# Altium schematic sheet 电源.SchDoc: 带±5V、±15V及USB供电的电源
size A4; DrawnBy: 冯某人; DocumentNumber: 1; Revision: 1
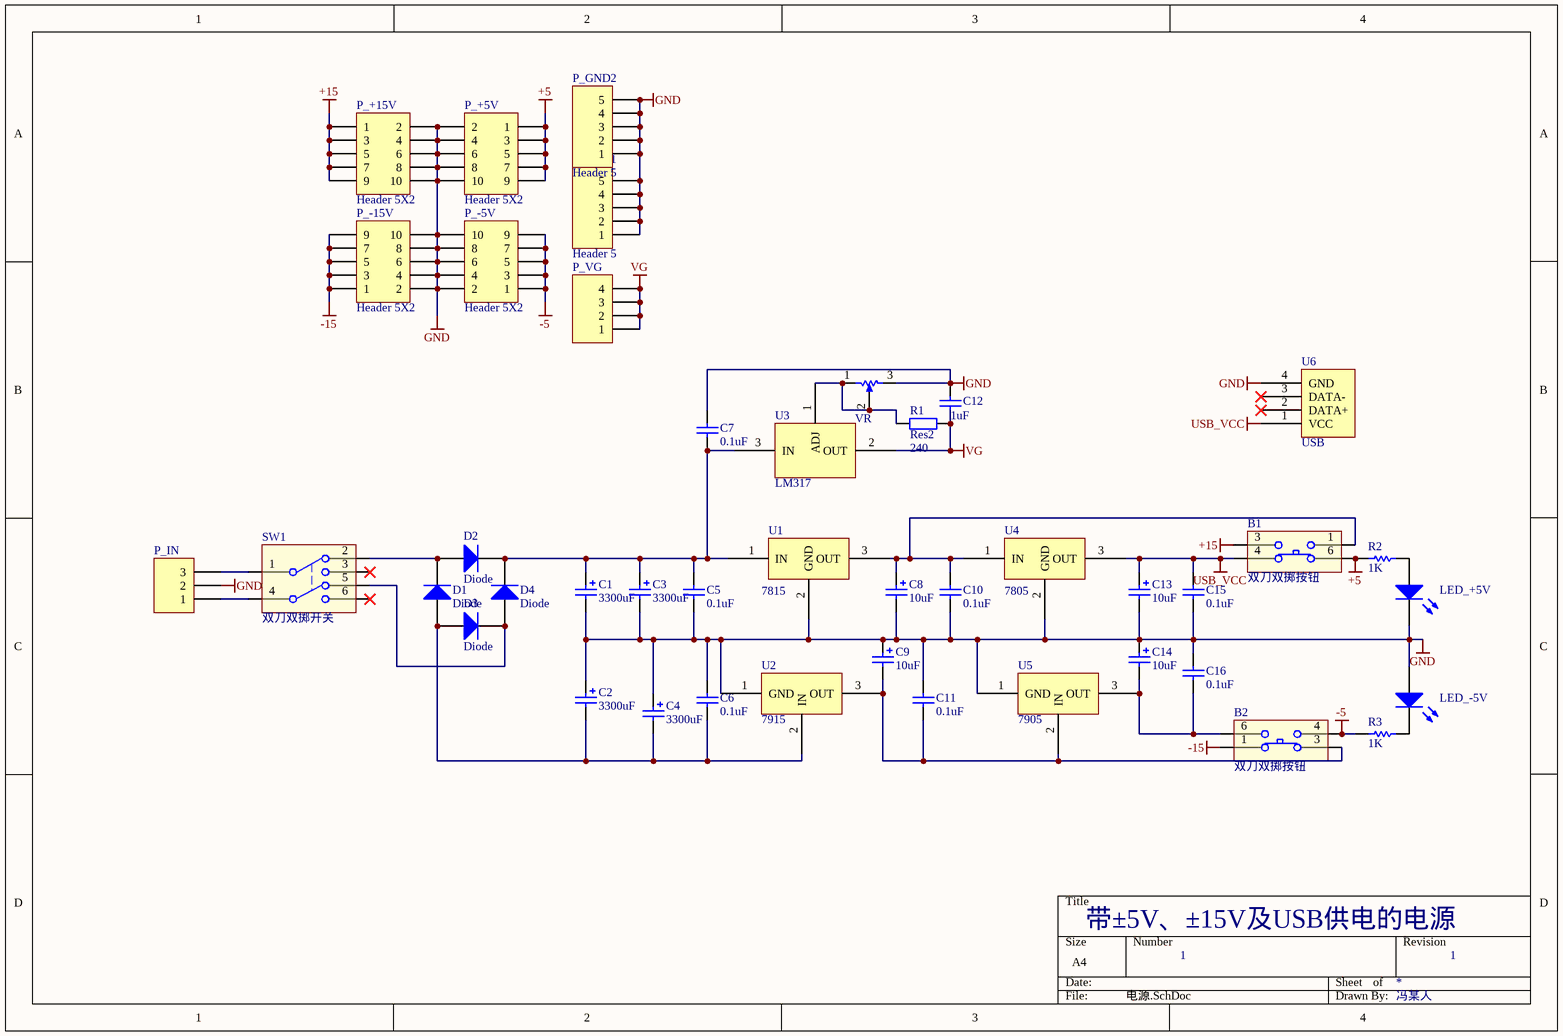
[diagram p0: 电源.SchDoc]

## Parts
B1  双刀双掷按钮  [双刀双掷开关]
B2  双刀双掷按钮  [双刀双掷开关]
C1  value 3300uF  [RB7.6-15]  (hidden comment: Cap Pol1)
C2  value 3300uF  [RB7.6-15]  (hidden comment: Cap Pol1)
C3  value 3300uF  [RB7.6-15]  (hidden comment: Cap Pol1)
C4  value 3300uF  [RB7.6-15]  (hidden comment: Cap Pol1)
C5  value 0.1uF  [RAD-0.1]  (hidden comment: Cap)
C6  value 0.1uF  [RAD-0.1]  (hidden comment: Cap)
C7  value 0.1uF  [RAD-0.1]  (hidden comment: Cap)
C8  value 10uF  [RAD-0.1]  (hidden comment: Cap Pol1)
C9  value 10uF  [RAD-0.1]  (hidden comment: Cap Pol1)
C10  value 0.1uF  [RAD-0.1]  (hidden comment: Cap)
C11  value 0.1uF  [RAD-0.1]  (hidden comment: Cap)
C12  value 1uF  [RAD-0.1]  (hidden comment: Cap)
C13  value 10uF  [RAD-0.1]  (hidden comment: Cap Pol1)
C14  value 10uF  [RAD-0.1]  (hidden comment: Cap Pol1)
C15  value 0.1uF  [RAD-0.1]  (hidden comment: Cap)
C16  value 0.1uF  [RAD-0.1]  (hidden comment: Cap)
D1  Diode  [DO-41]
D2  Diode  [DO-41]
D3  Diode  [DO-41]
D4  Diode  [DO-41]
LED_+5V  LED1  [HDR1X2]  (value not drawn)
LED_-5V  LED1  [HDR1X2]  (value not drawn)
P_+5V  Header 5X2  [HDR2X5]
P_+15V  Header 5X2  [HDR2X5]
P_-5V  Header 5X2  [HDR2X5]
P_-15V  Header 5X2  [HDR2X5]
P_GND1  Header 5  [HDR1X5]
P_GND2  Header 5  [HDR1X5]
P_IN  Header 3  [HDR1X3]  (value not drawn)
P_VG  Header 4  [HDR1X4]  (value not drawn)
R1  Res2  value 240  [AXIAL-0.3]
R2  value 1K  [AXIAL-0.3]  (hidden comment: Res Semi)
R3  value 1K  [AXIAL-0.3]  (hidden comment: Res Semi)
SW1  双刀双掷开关  [双刀双掷开关]
U1  7815  [HDR1X3]
U2  7915  [HDR1X3]
U3  LM317
U4  7805  [HDR1X3]
U5  7905  [HDR1X3]
U6  USB  [USB-A]
VR  variable resister  [HDR1X3]  (value not drawn)

## Nets
+5: B1.6 P_+5V.1 P_+5V.3 P_+5V.5 P_+5V.7 P_+5V.9 R2.2
+15: B1.3 P_+15V.1 P_+15V.3 P_+15V.5 P_+15V.7 P_+15V.9
-5: B2.4 P_-5V.1 P_-5V.3 P_-5V.5 P_-5V.7 P_-5V.9 R3.2
-15: B2.1 P_-15V.1 P_-15V.3 P_-15V.5 P_-15V.7 P_-15V.9
GND: C1.2 C2.1 C3.2 C4.1 C5.1 C6.2 C7.2 C8.2 C9.1 C10.1 C11.2 C12.1 C13.2 C14.1 C15.1 C16.2 LED_+5V.2(K) LED_-5V.1(A) P_+5V.2 P_+5V.4 P_+5V.6 P_+5V.8 P_+5V.10 P_+15V.2 P_+15V.4 P_+15V.6 P_+15V.8 P_+15V.10 P_-5V.2 P_-5V.4 P_-5V.6 P_-5V.8 P_-5V.10 P_-15V.2 P_-15V.4 P_-15V.6 P_-15V.8 P_-15V.10 P_GND1.1 P_GND1.2 P_GND1.3 P_GND1.4 P_GND1.5 P_GND2.1 P_GND2.2 P_GND2.3 P_GND2.4 P_GND2.5 P_IN.2 U1.2(GND) U2.1(GND) U4.2(GND) U5.1(GND) U6.4(GND) VR.3(ADJ)
USB_VCC: B1.4 C13.1 C15.2 U4.3(OUT) U6.1(VCC)
VG: C12.2 P_VG.1 P_VG.2 P_VG.3 P_VG.4 R1.1 U3.2(OUT)
NetB1_1: B1.1 C8.1 C10.2 U1.3(OUT) U4.1(IN)
NetB2_3: B2.3 C9.2 C11.1 U2.3(OUT) U5.2(IN)
NetB2_6: B2.6 C14.2 C16.1 U5.3(OUT)
NetC1_1: C1.1 C3.1 C5.2 C7.1 D2.2(K) D4.2(K) U1.1(IN) U3.3(IN)
NetC2_2: C2.2 C4.2 C6.1 D1.1(A) D3.1(A) U2.2(IN)
NetD1_2: D1.2(K) D2.1(A) SW1.2
NetD3_2: D3.2(K) D4.1(A) SW1.5
NetLED_+5V_1: LED_+5V.1(A) R2.1
NetLED_-5V_2: LED_-5V.2(K) R3.1
NetP_IN_1: P_IN.1 SW1.4
NetP_IN_3: P_IN.3 SW1.1
NetR1_2: R1.2 U3.1(ADJ) VR.1(IN) VR.2(OUT)

Not connected (* = marked no-connect by the designer): B1 2 5; B2 2 5; SW1 3* 6*; U6 2(DATA+)* 3(DATA-)* 5(NC) 6(NC)

## Library data of the parts
C1-C4 C8 C9 C13 C14 = Cap Pol1: Polarized Capacitor (Radial); Published: 8-Jun-2000; Publisher: Altium Limited; LatestRevisionDate: 17-Jul-2002; LatestRevisionNote: Re-released for DXP Platform.; PackageReference: RB7.6-15
C5-C7 C10-C12 C15 C16 = Cap: Capacitor; Published: 8-Jun-2000; Publisher: Altium Limited; LatestRevisionDate: 17-Jul-2002; LatestRevisionNote: Re-released for DXP Platform.; PackageReference: RAD-0.3
D1-D4 = Diode: Default Diode; Published: 8-Jun-2000; LatestRevisionDate: 17-Jul-2002; LatestRevisionNote: Re-released for DXP Platform.; PackageDocument: Sep-1996; PackageReference: SMC; Publisher: Altium Limited; Code_JEDEC: DO-214-AB
LED_+5V LED_-5V = LED1: Typical RED GaAs LED; Published: 8-Jun-2000; Publisher: Altium Limited; LatestRevisionDate: 08-Jul-2005; LatestRevisionNote: Mech Layer 1 removed.; PackageReference: LED-1
P_+5V P_+15V P_-5V P_-15V = Header 5X2: Header, 5-Pin, Dual row; Publisher: Altium Limited; LatestRevisionDate: 17-Jul-2002; LatestRevisionNote: Re-released for DXP Platform.
P_GND1 P_GND2 = Header 5: Header, 5-Pin; Publisher: Altium Limited; LatestRevisionDate: 17-Jul-2002; LatestRevisionNote: Re-released for DXP Platform.
P_IN = Header 3: Header, 3-Pin; Publisher: Altium Limited; LatestRevisionDate: 17-Jul-2002; LatestRevisionNote: Re-released for DXP Platform.
P_VG = Header 4: Header, 4-Pin; Publisher: Altium Limited; LatestRevisionDate: 17-Jul-2002; LatestRevisionNote: Re-released for DXP Platform.
R1 = Res2: Resistor; Published: 8-Jun-2000; Publisher: Altium Limited; LatestRevisionDate: 17-Jul-2002; LatestRevisionNote: Re-released for DXP Platform.; PackageReference: AXIAL-0.4
R2 R3 = Res Semi: Semiconductor Resistor; Published: 8-Jun-2000; Publisher: Altium Limited; LatestRevisionDate: 17-Jul-2002; LatestRevisionNote: Re-released for DXP Platform.; PackageReference: AXIAL-0.5
VR = vr